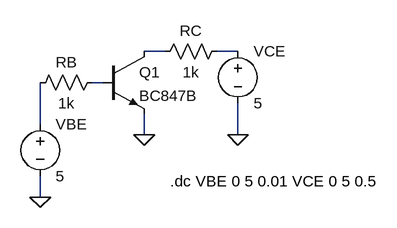
[diagram p0: schematic bjt_npn.asc]
bjt_npn.asc, the LTspice schematic file:
Version 4.1
SHEET 1 880 680
WIRE 256 112 224 112
WIRE 368 112 336 112
WIRE 160 160 144 160
WIRE 64 224 64 160
WIRE 224 240 224 208
WIRE 368 240 368 192
WIRE 64 336 64 304
FLAG 224 240 0
FLAG 368 240 0
FLAG 64 336 0
SYMBOL npn 160 112 R0
SYMATTR InstName Q1
SYMATTR Value BC847B
SYMBOL voltage 64 208 R0
WINDOW 123 0 0 Left 0
WINDOW 39 0 0 Left 0
SYMATTR InstName VBE
SYMATTR Value 5
SYMBOL voltage 368 96 R0
WINDOW 123 0 0 Left 0
WINDOW 39 0 0 Left 0
SYMATTR InstName VCE
SYMATTR Value 5
SYMBOL res 352 96 R90
WINDOW 0 0 56 VBottom 2
WINDOW 3 32 56 VTop 2
SYMATTR InstName RC
SYMATTR Value 1k
SYMBOL res 160 144 R90
WINDOW 0 0 56 VBottom 2
WINDOW 3 32 56 VTop 2
SYMATTR InstName RB
SYMATTR Value 1k
TEXT 264 312 Left 2 !.dc VBE 0 5 0.01 VCE 0 5 0.5

The netlist it stands for:
* bjt_npn.asc
Q1 N001 N003 0 0 BC847B
VBE N004 0 5
VCE N002 0 5
RC N002 N001 1k
RB N003 N004 1k
.model NPN NPN
.model PNP PNP
.lib standard.bjt
.dc VBE 0 5 0.01 VCE 0 5 0.5
.backanno
.end

* Results of the author's LTspice run, read from the files saved beside the schematic
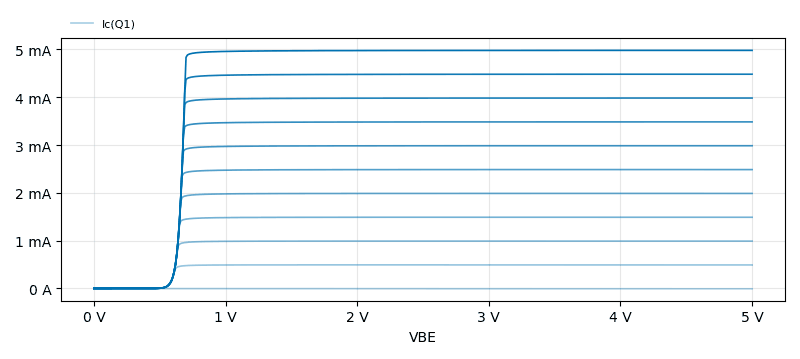
[diagram p1: DC transfer characteristic of bjt_npn.asc, plotted from the saved traces]
* DC transfer characteristic, 11 runs:
*   Ic(Q1) [VCE=0]: 0 A at VBE=0 V, -7.355 µA at VBE=5 V, min -7.355 µA, max 0 A
*   Ic(Q1) [VCE=0.5]: 10.5 pA at VBE=0 V, 491.5 µA at VBE=5 V, min 9.23 pA, max 493.4 µA
*   Ic(Q1) [VCE=1]: 11 pA at VBE=0 V, 990.3 µA at VBE=5 V, min 9.727 pA, max 991.6 µA
*   Ic(Q1) [VCE=1.5]: 10.23 pA at VBE=0 V, 1.489 mA at VBE=5 V, min 10.23 pA, max 1.49 mA
*   Ic(Q1) [VCE=2]: 12 pA at VBE=0 V, 1.988 mA at VBE=5 V, min 10.73 pA, max 1.989 mA
*   Ic(Q1) [VCE=2.5]: 12.5 pA at VBE=0 V, 2.487 mA at VBE=5 V, min 11.23 pA, max 2.487 mA
*   Ic(Q1) [VCE=3]: 11.73 pA at VBE=0 V, 2.986 mA at VBE=5 V, min 11.73 pA, max 2.986 mA
*   Ic(Q1) [VCE=3.5]: 13.5 pA at VBE=0 V, 3.485 mA at VBE=5 V, min 12.23 pA, max 3.485 mA